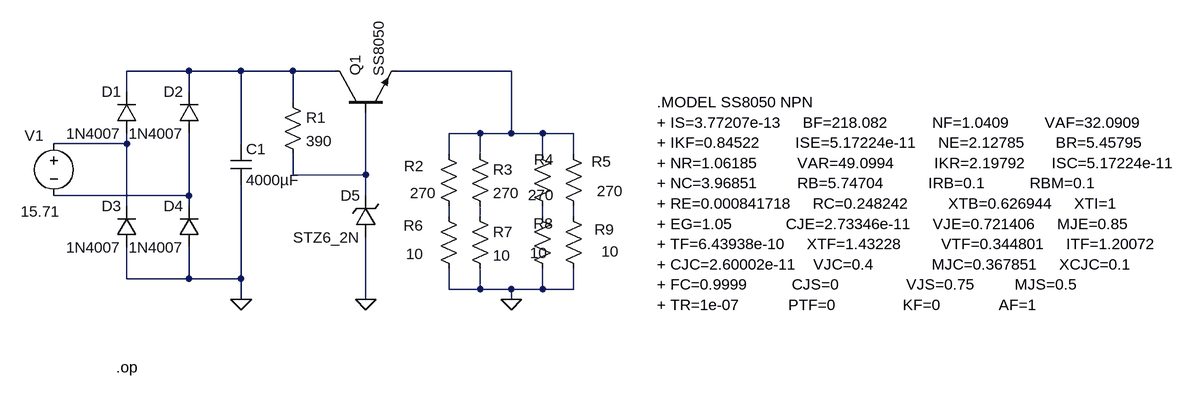
[diagram p0: schematic Prjetp.asc]
Prjetp.asc, the LTspice schematic file:
Version 4.1
SHEET 1 1820 904
WIRE 144 32 48 32
WIRE 224 32 144 32
WIRE 304 32 224 32
WIRE 368 32 304 32
WIRE 640 32 464 32
WIRE 48 64 48 32
WIRE 144 64 144 32
WIRE 304 80 304 32
WIRE 592 128 544 128
WIRE 640 128 640 32
WIRE 640 128 592 128
WIRE 688 128 640 128
WIRE 736 128 688 128
WIRE 48 144 48 128
WIRE 48 144 -64 144
WIRE 224 144 224 32
WIRE 544 160 544 128
WIRE 592 160 592 128
WIRE 688 160 688 128
WIRE 736 160 736 128
WIRE 304 192 304 160
WIRE 416 192 416 96
WIRE 416 192 304 192
WIRE 144 224 144 128
WIRE 144 224 -64 224
WIRE 416 224 416 192
WIRE 48 240 48 144
WIRE 144 240 144 224
WIRE 544 256 544 240
WIRE 592 256 592 240
WIRE 688 256 688 240
WIRE 736 256 736 240
WIRE 48 352 48 304
WIRE 144 352 144 304
WIRE 144 352 48 352
WIRE 224 352 224 208
WIRE 224 352 144 352
WIRE 544 368 544 336
WIRE 592 368 592 336
WIRE 592 368 544 368
WIRE 640 368 592 368
WIRE 688 368 688 336
WIRE 688 368 640 368
WIRE 736 368 736 336
WIRE 736 368 688 368
WIRE 224 384 224 352
WIRE 416 384 416 288
WIRE 640 384 640 368
FLAG 224 384 0
FLAG 416 384 0
FLAG 640 384 0
SYMBOL voltage -64 128 R0
WINDOW 0 -45 3 Left 2
WINDOW 3 -51 120 Left 2
SYMATTR InstName V1
SYMATTR Value 15.71
SYMBOL diode 64 128 R180
WINDOW 0 24 64 Left 2
WINDOW 3 24 0 Left 2
SYMATTR InstName D1
SYMATTR Value 1N4007
SYMBOL diode 160 128 R180
WINDOW 0 24 64 Left 2
WINDOW 3 24 0 Left 2
SYMATTR InstName D2
SYMATTR Value 1N4007
SYMBOL diode 64 304 R180
WINDOW 0 24 64 Left 2
WINDOW 3 24 0 Left 2
SYMATTR InstName D3
SYMATTR Value 1N4007
SYMBOL diode 160 304 R180
WINDOW 0 24 64 Left 2
WINDOW 3 24 0 Left 2
SYMATTR InstName D4
SYMATTR Value 1N4007
SYMBOL cap 208 144 R0
SYMATTR InstName C1
SYMATTR Value 4000µF
SYMBOL npn 368 96 R270
SYMATTR InstName Q1
SYMATTR Value SS8050
SYMBOL zener 432 288 R180
WINDOW 0 24 64 Left 2
WINDOW 3 24 0 Left 2
SYMATTR InstName D5
SYMATTR Value STZ6_2N
SYMBOL res 288 64 R0
SYMATTR InstName R1
SYMATTR Value 390
SYMBOL res 528 144 R0
WINDOW 0 -53 34 Left 2
WINDOW 3 -44 76 Left 2
SYMATTR InstName R2
SYMATTR Value 270
SYMBOL res 576 144 R0
SYMATTR InstName R3
SYMATTR Value 270
SYMBOL res 672 144 R0
WINDOW 0 3 24 Left 2
WINDOW 3 -6 79 Left 2
SYMATTR InstName R4
SYMATTR Value 270
SYMBOL res 720 144 R0
WINDOW 0 43 27 Left 2
WINDOW 3 52 73 Left 2
SYMATTR InstName R5
SYMATTR Value 270
SYMBOL res 528 240 R0
WINDOW 0 -54 30 Left 2
WINDOW 3 -50 74 Left 2
SYMATTR InstName R6
SYMATTR Value 10
SYMBOL res 576 240 R0
SYMATTR InstName R7
SYMATTR Value 10
SYMBOL res 672 240 R0
WINDOW 0 2 27 Left 2
WINDOW 3 -3 72 Left 2
SYMATTR InstName R8
SYMATTR Value 10
SYMBOL res 720 240 R0
WINDOW 0 48 36 Left 2
WINDOW 3 59 70 Left 2
SYMATTR InstName R9
SYMATTR Value 10
TEXT 864 80 Left 2 !.MODEL SS8050 NPN\n+ IS=3.77207e-13     BF=218.082          NF=1.0409        VAF=32.0909\n+ IKF=0.84522        ISE=5.17224e-11     NE=2.12785       BR=5.45795\n+ NR=1.06185         VAR=49.0994         IKR=2.19792      ISC=5.17224e-11\n+ NC=3.96851         RB=5.74704          IRB=0.1          RBM=0.1\n+ RE=0.000841718     RC=0.248242         XTB=0.626944     XTI=1\n+ EG=1.05            CJE=2.73346e-11     VJE=0.721406     MJE=0.85\n+ TF=6.43938e-10     XTF=1.43228         VTF=0.344801     ITF=1.20072\n+ CJC=2.60002e-11    VJC=0.4             MJC=0.367851     XCJC=0.1\n+ FC=0.9999          CJS=0               VJS=0.75         MJS=0.5\n+ TR=1e-07           PTF=0               KF=0             AF=1
TEXT 32 488 Left 2 !.op

The netlist it stands for:
* Prjetp.asc
V1 N003 N005 15.71
D1 N003 N001 1N4007
D2 N005 N001 1N4007
D3 0 N003 1N4007
D4 0 N005 1N4007
C1 N001 0 4000µF
Q1 N001 N004 N002 0 SS8050
D5 0 N004 STZ6_2N
R1 N001 N004 390
R2 N002 N006 270
R3 N002 N007 270
R4 N002 N008 270
R5 N002 N009 270
R6 N006 0 10
R7 N007 0 10
R8 N008 0 10
R9 N009 0 10
.model D D
.lib standard.dio
.model NPN NPN
.model PNP PNP
.lib standard.bjt
.MODEL SS8050 NPN
+ IS=3.77207e-13     BF=218.082          NF=1.0409        VAF=32.0909
+ IKF=0.84522        ISE=5.17224e-11     NE=2.12785       BR=5.45795
+ NR=1.06185         VAR=49.0994         IKR=2.19792      ISC=5.17224e-11
+ NC=3.96851         RB=5.74704          IRB=0.1          RBM=0.1
+ RE=0.000841718     RC=0.248242         XTB=0.626944     XTI=1
+ EG=1.05            CJE=2.73346e-11     VJE=0.721406     MJE=0.85
+ TF=6.43938e-10     XTF=1.43228         VTF=0.344801     ITF=1.20072
+ CJC=2.60002e-11    VJC=0.4             MJC=0.367851     XCJC=0.1
+ FC=0.9999          CJS=0               VJS=0.75         MJS=0.5
+ TR=1e-07           PTF=0               KF=0             AF=1
.op
.backanno
.end